# Altium schematic sheet KickerInterface.SchDoc: Connection vers kicker
size Letter; Organization: Robocup Ulaval; DocumentNumber: 9; Revision: 1.0; SheetNumber: 9; SheetTotal: 10; Version: Gamma 1.0; Conceptor: Philippe T. Simon B. Léonard G. Alexia B-L.
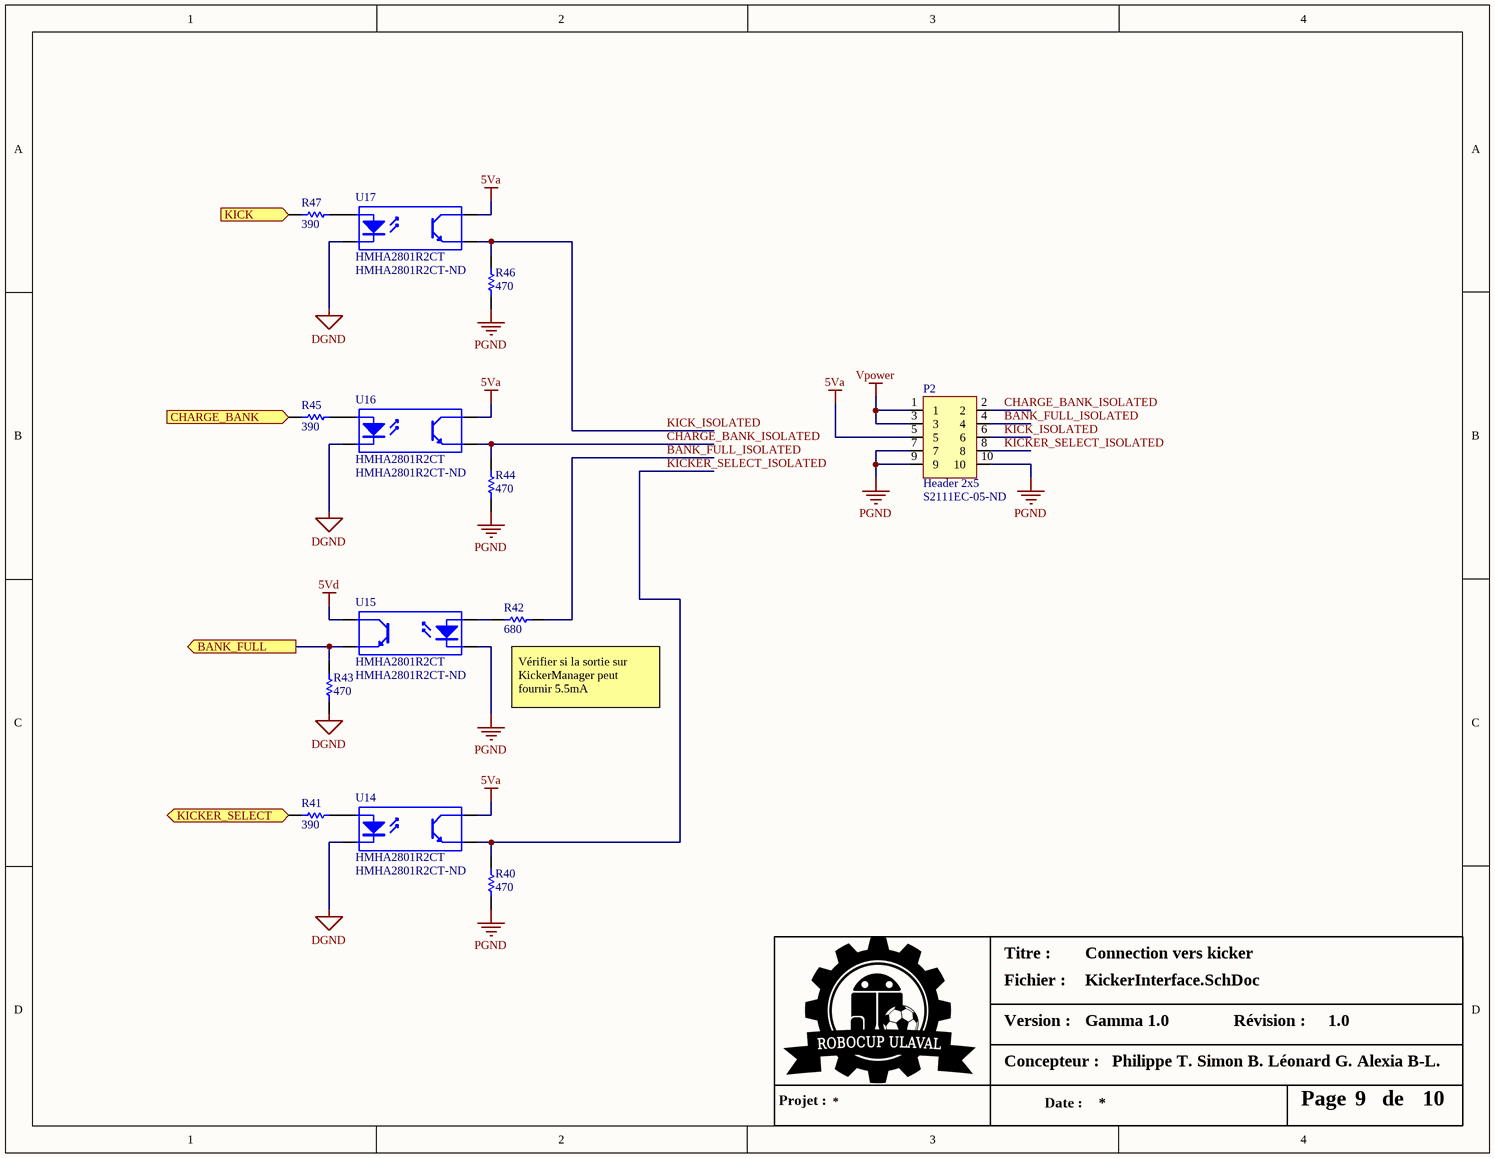
[diagram p0: KickerInterface.SchDoc]

## Parts
P2  Header 2x5  Supplier Part Number 2: S2111EC-05-ND  [HDR2x5_Right_Angle]
R40  Resistance (Ohms): 470  [0603]  (hidden comment: RC0603JR-07470RL)
R41  Resistance (Ohms): 390  [0603]  (hidden comment: RC0603JR-07390RL)
R42  Resistance (Ohms): 680  [0603]  (hidden comment: RC0603JR-07680RL)
R43  Resistance (Ohms): 470  [0603]  (hidden comment: RC0603JR-07470RL)
R44  Resistance (Ohms): 470  [0603]  (hidden comment: RC0603JR-07470RL)
R45  Resistance (Ohms): 390  [0603]  (hidden comment: RC0603JR-07390RL)
R46  Resistance (Ohms): 470  [0603]  (hidden comment: RC0603JR-07470RL)
R47  Resistance (Ohms): 390  [0603]  (hidden comment: RC0603JR-07390RL)
U14  HMHA2801R2CT  Supplier Part Number 1: HMHA2801R2CT-ND  [SOIC127P700X220-4N]
U15  HMHA2801R2CT  Supplier Part Number 1: HMHA2801R2CT-ND  [SOIC127P700X220-4N]
U16  HMHA2801R2CT  Supplier Part Number 1: HMHA2801R2CT-ND  [SOIC127P700X220-4N]
U17  HMHA2801R2CT  Supplier Part Number 1: HMHA2801R2CT-ND  [SOIC127P700X220-4N]

## Ports
BANK_FULL (out), CHARGE_BANK (in), KICK (in), KICKER_SELECT (in)

## Nets
5Va: P2.5 U14.4(C) U16.4(C) U17.4(C)
5Vd: U15.4(C)
DGND: R43.1 U14.2(K) U16.2(K) U17.2(K)
PGND: P2.7 P2.9 P2.10 R40.1 R44.1 R46.1 U15.2(K)
Vpower: P2.1 P2.3
BANK_FULL: R43.2 U15.3(E) ; port BANK_FULL
BANK_FULL_ISOLATED: P2.4 R42.2
CHARGE_BANK: R45.1 ; port CHARGE_BANK
CHARGE_BANK_ISOLATED: P2.2 R44.2 U16.3(E)
KICK: R47.1 ; port KICK
KICK_ISOLATED: P2.6 R46.2 U17.3(E)
KICKER_SELECT: R41.1 ; port KICKER_SELECT
KICKER_SELECT_ISOLATED: P2.8 R40.2 U14.3(E)
NetR41_2: R41.2 U14.1(A)
NetR42_1: R42.1 U15.1(A)
NetR45_2: R45.2 U16.1(A)
NetR47_2: R47.2 U17.1(A)

## Notes on the sheet
- (near R42) Vérifier si la sortie sur KickerManager peut fournir 5.5mA
- Titre :
- Version :
- Fichier :
- Révision :
- Projet :
- Concepteur :
- Date :
- Page
- de

## Library data of the parts
P2 = header 2x5 100mil right angle: Header 10pins 2 rows 100mil right angle; Supplier 1: Digi-Key; Supplier 2: Digi-Key
R40 R43 R44 R46 = RC0603JR-07470RL: RES SMD 470 OHM 5% 1/10W 0603; Manufacturer: Yageo; Power (Watts): 0.1W, 1/10W; Temperature Coefficient: ±100ppm/°C; Supplier 1: Digi-Key; Manufacturer Part Number: RC0603JR-07470RL; RoHS: RoHS Compliant; Category: Resistors; Stock 1: 968246; Pricing 1: 1=0.15, 10=0.017, 25=0.012, 100=0.0067, 250=0.00508, 500=0.00408, 1000=0.003, 2500=0.0026 (CAD); Packaging: Cut Tape (CT); Tolerance: ±5%; Composition: Thick Film; Features: Moisture Resistant; Operating Temperature: -55°C ~ 155°C; Package / Case: 0603 (1608 Metric); Supplier Device Package: 0603; Size / Dimension: 0.063" L x 0.031" W (1.60mm x 0.80mm); Height: 0.022" (0.55mm); Number of Terminations: 2; ComponentLink1URL: http://www.yageo.com/documents/recent/PYu-RC_Group_51_RoHS_L_04.pdf; ComponentLink1Description: http://www.yageo.com/documents/recent/PYu-RC_Group_51_RoHS_L_04.pdf; Supplier Part Number 1: 311-470GRCT-ND
R41 R45 R47 = RC0603JR-07390RL: RES SMD 390 OHM 5% 1/10W 0603; Manufacturer: Yageo; Power (Watts): 0.1W, 1/10W; Temperature Coefficient: ±100ppm/°C; Supplier 1: Digi-Key; Manufacturer Part Number: RC0603JR-07390RL; RoHS: RoHS Compliant; Category: Resistors; Stock 1: 718727; Pricing 1: 1=0.15, 10=0.017, 25=0.012, 100=0.0067, 250=0.00508, 500=0.00408, 1000=0.003, 2500=0.0026 (CAD); Packaging: Cut Tape (CT); Tolerance: ±5%; Composition: Thick Film; Features: Moisture Resistant; Operating Temperature: -55°C ~ 155°C; Package / Case: 0603 (1608 Metric); Supplier Device Package: 0603; Size / Dimension: 0.063" L x 0.031" W (1.60mm x 0.80mm); Height: 0.022" (0.55mm); Number of Terminations: 2; ComponentLink1URL: http://www.yageo.com/documents/recent/PYu-RC_Group_51_RoHS_L_04.pdf; ComponentLink1Description: http://www.yageo.com/documents/recent/PYu-RC_Group_51_RoHS_L_04.pdf; Supplier Part Number 1: 311-390GRCT-ND
R42 = RC0603JR-07680RL: RES SMD 680 OHM 5% 1/10W 0603; Manufacturer: Yageo; Power (Watts): 0.1W, 1/10W; Temperature Coefficient: ±100ppm/°C; Supplier 1: Digi-Key; Manufacturer Part Number: RC0603JR-07680RL; RoHS: RoHS Compliant; Category: Resistors; Stock 1: 125041; Pricing 1: 1=0.15, 10=0.017, 25=0.012, 100=0.0067, 250=0.00508, 500=0.00408, 1000=0.003, 2500=0.0026 (CAD); Packaging: Cut Tape (CT); Tolerance: ±5%; Composition: Thick Film; Features: Moisture Resistant; Operating Temperature: -55°C ~ 155°C; Package / Case: 0603 (1608 Metric); Supplier Device Package: 0603; Size / Dimension: 0.063" L x 0.031" W (1.60mm x 0.80mm); Height: 0.022" (0.55mm); Number of Terminations: 2; ComponentLink1URL: http://www.yageo.com/documents/recent/PYu-RC_Group_51_RoHS_L_04.pdf; ComponentLink1Description: http://www.yageo.com/documents/recent/PYu-RC_Group_51_RoHS_L_04.pdf; Supplier Part Number 1: 311-680GRCT-ND
U14-U17 = HMHA2801R2CT: OPTOISOLATOR 3.75KV TRANS 4-SO; Supplier 1: Digi-Key